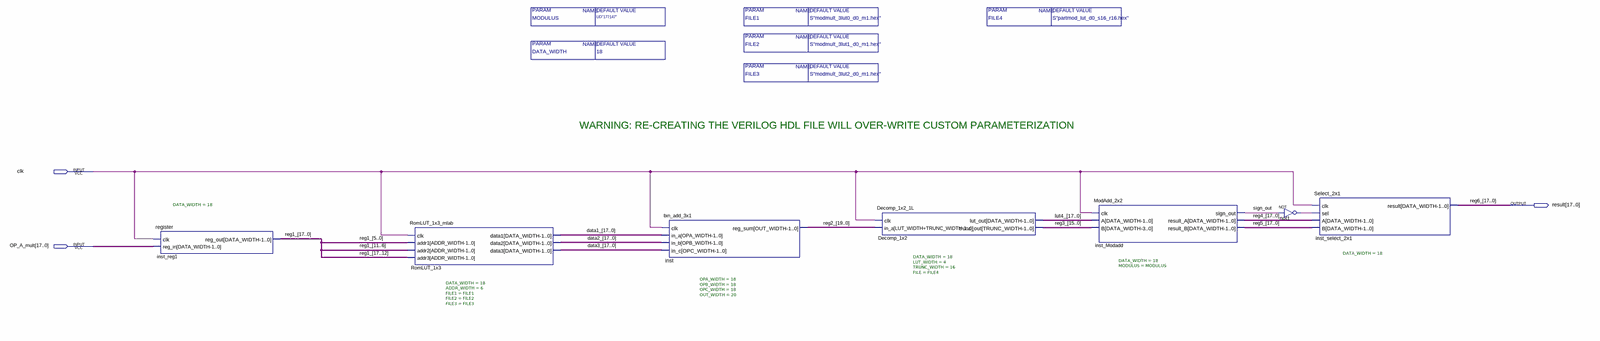
[diagram p0: schematic sheet, whole]
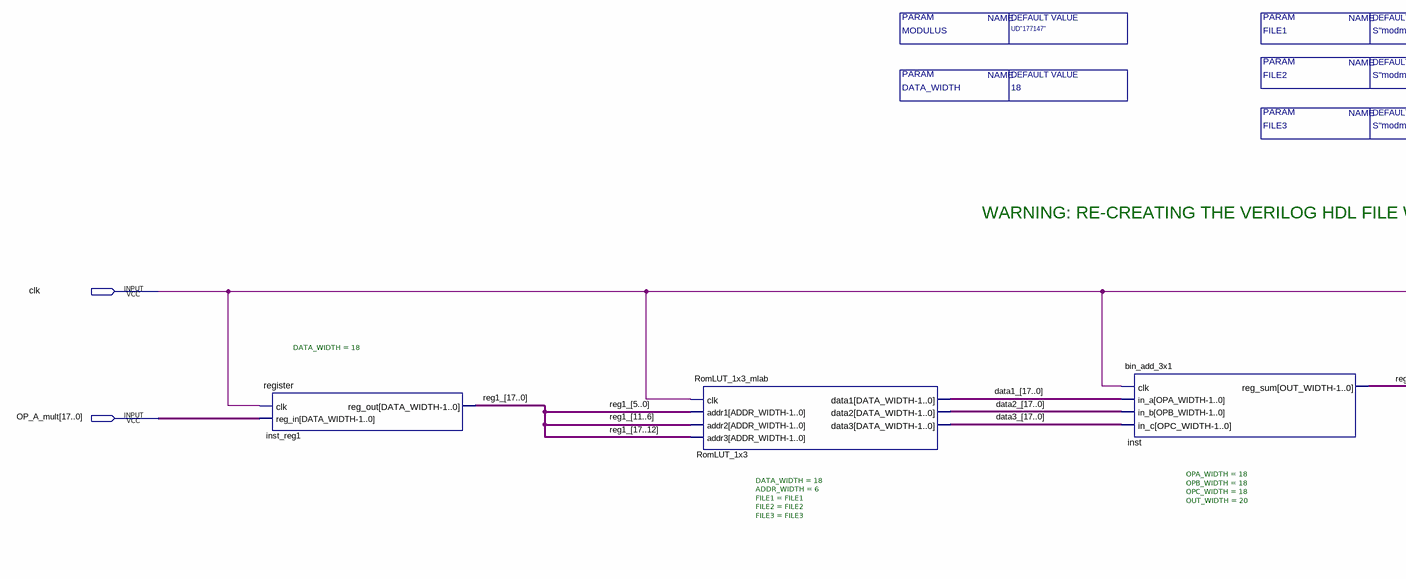
[diagram p1: schematic sheet, left part]
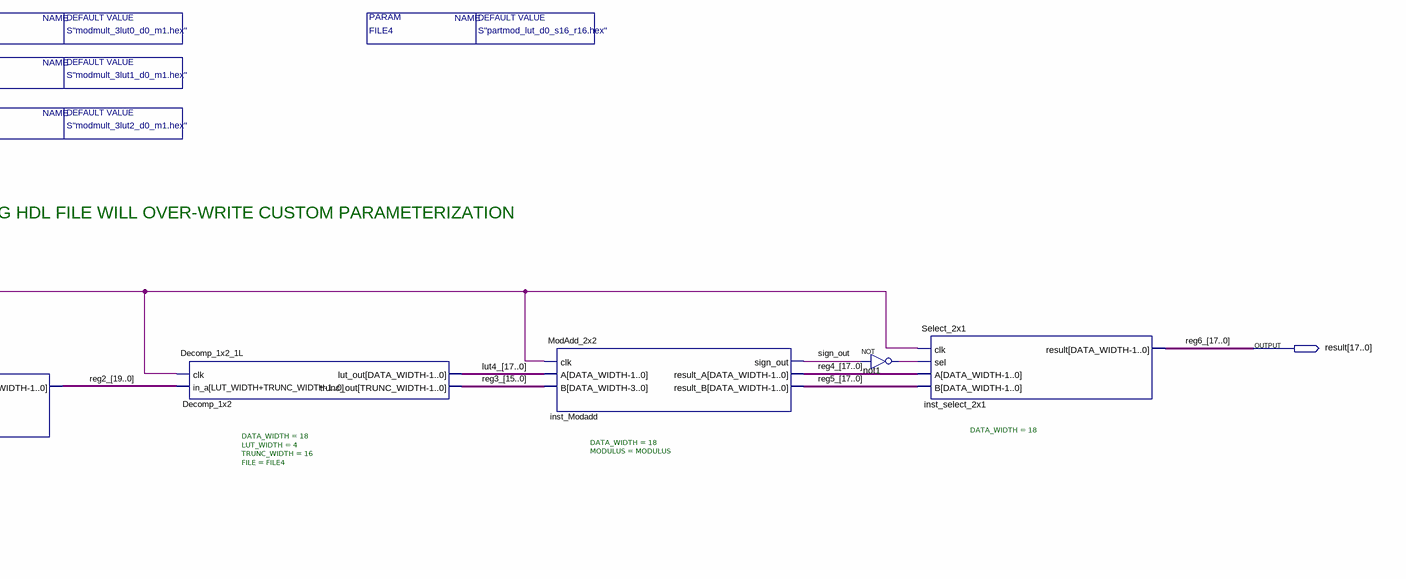
[diagram p2: schematic sheet, right part]
// Quartus schematic ModMultC_xL.bdf as structural Verilog: 7 symbols, 3 pins
module ModMultC_xL #(parameter MODULUS = "UD\"177147\"", parameter DATA_WIDTH = 18, parameter FILE4 = "S\"partmod_lut_d0_s16_r16.hex\"", parameter FILE1 = "S\"modmult_3lut0_d0_m1.hex\"", parameter FILE2 = "S\"modmult_3lut1_d0_m1.hex\"", parameter FILE3 = "S\"modmult_3lut2_d0_m1.hex\"") (
  input  clk,
  input  [17:0] OP_A_mult,
  output [17:0] result
);

  wire not1_out, sign_out;
  wire [15:0] reg3_;
  wire [17:0] data1_, data2_, data3_, lut4_, reg1_, reg4_, reg5_;
  wire [19:0] reg2_;

  register #(.DATA_WIDTH(18)) inst_reg1 (.clk(clk), .reg_in(OP_A_mult), .reg_out(reg1_));
  RomLUT_1x3_mlab #(.DATA_WIDTH(18), .ADDR_WIDTH(6), .FILE1(FILE1), .FILE2(FILE2), .FILE3(FILE3)) RomLUT_1x3 (
    .clk(clk), .addr1(reg1_[5:0]), .addr2(reg1_[11:6]), .addr3(reg1_[17:12]), .data1(data1_), .data2(data2_),
    .data3(data3_));
  bin_add_3x1 #(.OPA_WIDTH(18), .OPB_WIDTH(18), .OPC_WIDTH(18), .OUT_WIDTH(20)) inst (
    .clk(clk), .in_a(data1_), .in_b(data2_), .in_c(data3_), .reg_sum(reg2_));
  Decomp_1x2_1L #(.DATA_WIDTH(18), .LUT_WIDTH(4), .TRUNC_WIDTH(16), .FILE(FILE4)) Decomp_1x2 (
    .clk(clk), .in_a(reg2_), .lut_out(lut4_), .trunc_out(reg3_));
  ModAdd_2x2 #(.DATA_WIDTH(18), .MODULUS(MODULUS)) inst_Modadd (
    .clk(clk), .A(lut4_), .B(reg3_), .sign_out(sign_out), .result_A(reg4_), .result_B(reg5_));
  not not1 (not1_out, sign_out);
  Select_2x1 #(.DATA_WIDTH(18)) inst_select_2x1 (.clk(clk), .sel(not1_out), .A(reg4_), .B(reg5_), .result(result));

  // Other names for the same wires on the sheet: reg6_[17:0] = result

  // Notes on the sheet:
  //   WARNING: RE-CREATING THE VERILOG HDL FILE WILL OVER-WRITE CUSTOM PARAMETERIZATION
endmodule
